# EAGLE design polar_lcd (EAGLE 9.3.0)
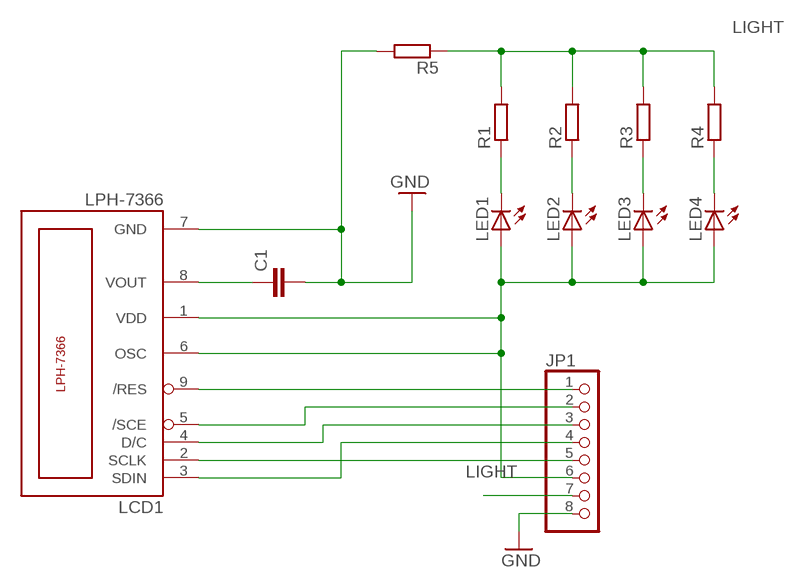
[diagram p0: schematic, sheet 1]

## Parts
C1  C-EUC0805  [C0805]
JP1  PINHD-1X8  [1X08]
LCD1  LPH-7366  [LPH-7366]
LED1  LEDSMT1206  [1206]
LED2  LEDSMT1206  [1206]
LED3  LEDSMT1206  [1206]
LED4  LEDSMT1206  [1206]
R1  R-EU_R0805  [R0805]
R2  R-EU_R0805  [R0805]
R3  R-EU_R0805  [R0805]
R4  R-EU_R0805  [R0805]
R5  R-EU_R0805  [R0805]

## Nets
GND: C1.2 JP1.8 LCD1.7(GND) R5.2
LIGHT: JP1.7 R1.2 R2.2 R3.2 R4.2 R5.1
N$1: JP1.1 LCD1.9(/RES)
N$2: C1.1 LCD1.8(VOUT)
N$3: JP1.6 LCD1.1(VDD) LCD1.6(OSC) LED1.A LED2.A LED3.A LED4.A
N$4: LED1.C R1.1
N$5: LED2.C R2.1
N$6: LED3.C R3.1
N$7: LED4.C R4.1
N$8: JP1.5 LCD1.2(SCLK)
N$9: JP1.4 LCD1.3(SDIN)
N$10: JP1.3 LCD1.4(D/C)
N$11: JP1.2 LCD1.5(/SCE)

## Library data of the parts
C1 = rcl:C-EU: CAPACITOR, European symbol; SPICEPREFIX: C
JP1 = pinhead:PINHD-1X8: PIN HEADER
LCD1 = lph-7366 (1):LPH-7366
LED1-LED4 = RepRapjr (1):LED: LED OSRAM: - CHIPLED LG R971, LG N971, LY N971, LG Q971, LY Q971, LO R971, LY R971 LH N974, LH R974 LS Q976, LO Q976, LY Q976 LO Q996 - Hyper CHIPLED LW Q18S LB Q993, LB Q99A, LB R99A - SideLED LS A670, LO A670, LY A670, LG A670, LP A670 LB A673, LV A673, LT A673, LW A673 LH A674 LY A675 LS A676, LA A676, LO A676, LY A676, LW A676 LS A679, LY A679, LG A679 - Hyper Micro SIDELED® LS Y876, LA Y876, LO Y876, LY Y876 LT Y87S - SmartLED LW L88C, LW L88S LB L89C, LB L89S, LG L890 LS L89K, LO L89K, LY L89K LS L896, LA L896, LO L896, LY L896 - TOPLED LS T670, LO T670, LY T670, LG T670, LP T670 LSG T670, LSP T670, LSY T670, LOP T670, LYG T670 LG T671, LOG T671, LSG T671 LB T673, LV T673, LT T673, LW T673 LH T674 LS T676, LA T676, LO T676, LY T676, LB T676, LH T676, LSB T676, LW T676 LB T67C, LV T67C, LT T67C, LS T67K, LO T67K, LY T67K, LW E67C LS E67B, LA E67B, LO E67B, LY E67B, LB E67C, LV E67C, LT E67C LW T67C LS T679, LY T679, LG T679 LS T770, LO T770, LY T770, LG T770, LP T770 LB T773, LV T773, LT T773, LW T773 LH T774 LS E675, LA E675, LY E675, LS T675 LS T776, LA T776, LO T776, LY T776, LB T776 LHGB T686 LT T68C, LB T68C - Hyper Mini TOPLED® LB M676 - Mini TOPLED Santana® LG M470 LS M47K, LO M47K, LY M47K Source: http://www.osram.convergy.de LUXEON: - LUMILED® LXK2-PW12-R00, LXK2-PW12-S00, LXK2-PW14-U00, LXK2-PW14-V00 LXK2-PM12-R00, LXK2-PM12-S00, LXK2-PM14-U00 LXK2-PE12-Q00, LXK2-PE12-R00, LXK2-PE12-S00, LXK2-PE14-T00, LXK2-PE14-U00 LXK2-PB12-K00, LXK2-PB12-L00, LXK2-PB12-M00, LXK2-PB14-N00, LXK2-PB14-P00, LXK2-PB14-Q00 LXK2-PR12-L00, LXK2-PR12-M00, LXK2-PR14-Q00, LXK2-PR14-R00 LXK2-PD12-Q00, LXK2-PD12-R00, LXK2-PD12-S00 LXK2-PH12-R00, LXK2-PH12-S00 LXK2-PL12-P00, LXK2-PL12-Q00, LXK2-PL12-R00 Source: www.luxeon.com KINGBRIGHT: KA-3528ASYC Source: www.kingbright.com
R1-R5 = rcl:R-EU_: RESISTOR, European symbol; SPICEPREFIX: R

## Board
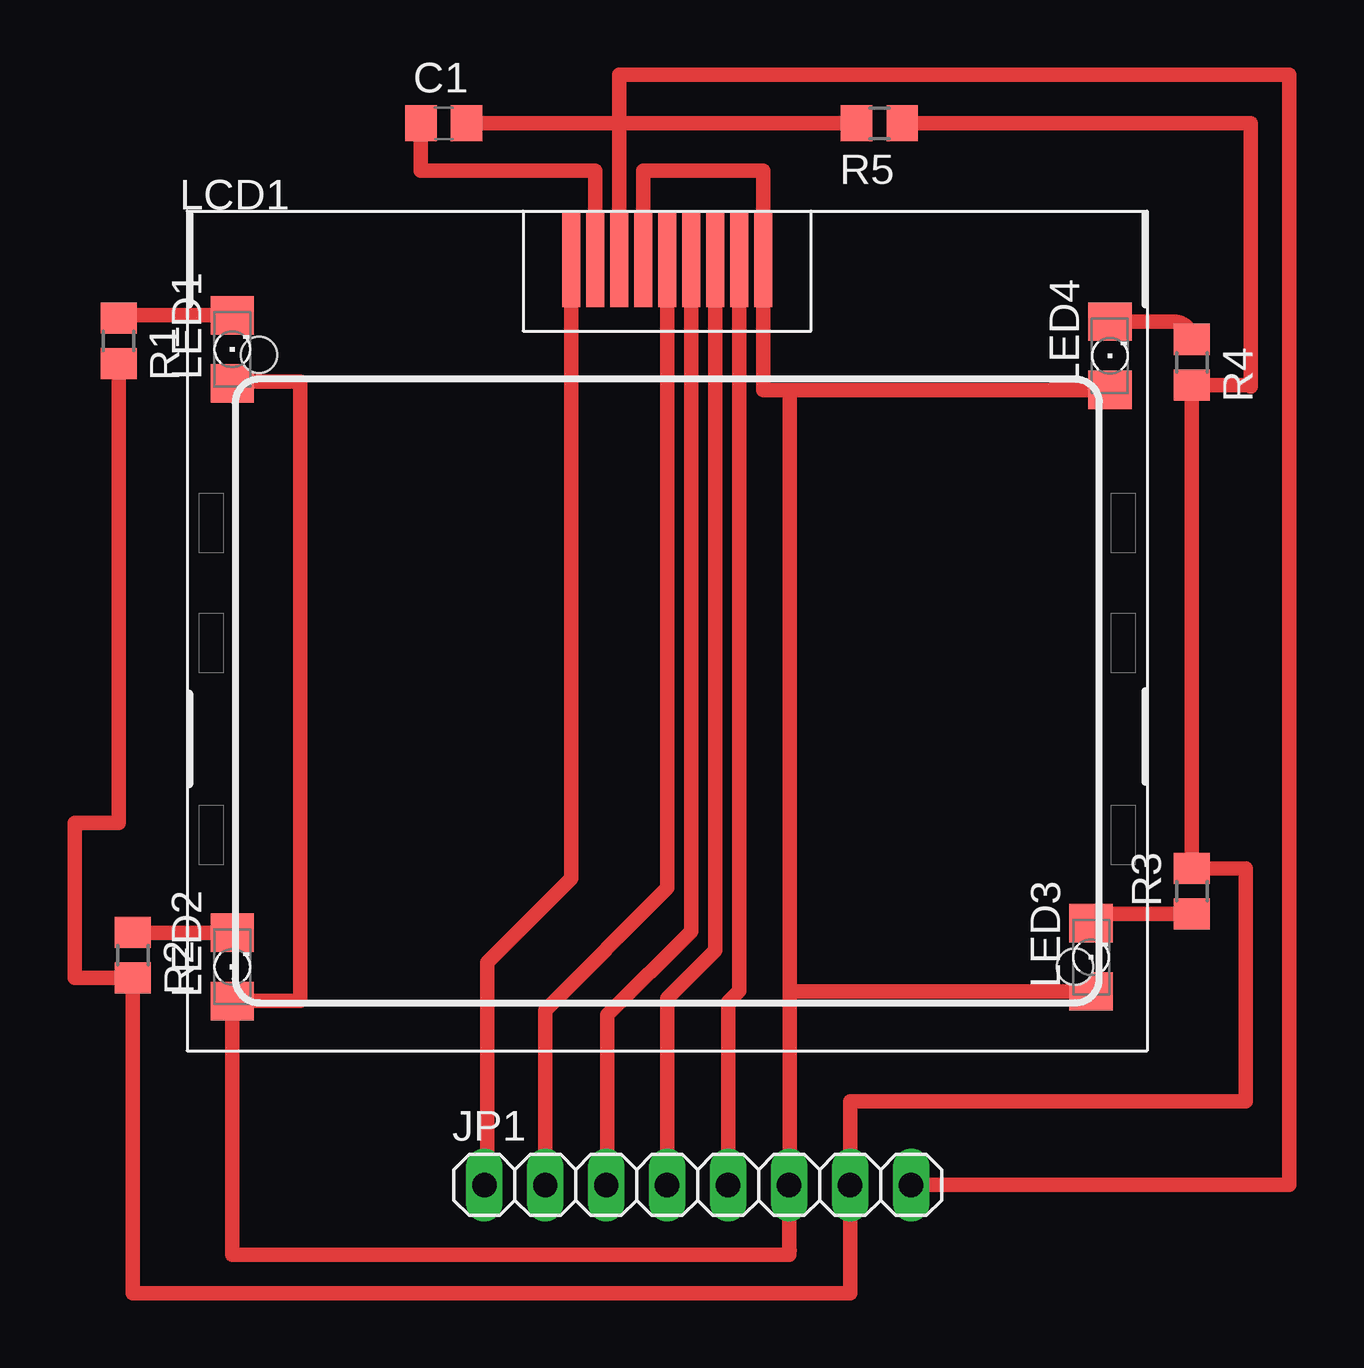
[diagram p1: board, top side]

No outline drawn. Coordinates in mm, seen from the top.
Copper layers (1*16): Top 0.035mm / dielectric 1.5mm / Bottom 0.035mm
Design rules "default": minimum track width 6mil, minimum drill 0.35mm, track to track 6mil, track to pad 6mil, pad to pad 6mil, via to via 6mil, smd to smd 6mil, copper to edge 40mil, drill to drill 6mil, minimum pad ring 10mil, minimum via ring 8mil, stop-mask expansion 4mil, vias tented up to drill 0mil, thermal gap 10mil

### Footprints (pad centres in the part's own frame; a part is rotated, then mirrored left to right if it is on the bottom)
C0805 = smd 1.3 x 1.5: 1 -0.95,0; 2 0.95,0
1X08 = drill 1.016 long: 1 -8.89,0; 2 -6.35,0; 3 -3.81,0; 4 -1.27,0; 5 1.27,0; 6 3.81,0; 7 6.35,0; 8 8.89,0
LPH-7366 = smd 0.75 x 4: 1 4,17; 2 3,17; 3 2,17; 4 1,17; 5 0,17; 6 -1,17; 7 -2,17; 8 -3,17; 9 -4,17 | hole 1.5: -17,13; 17,-12.5
1206 = smd 1.6 x 1.803: A -1.422,0; C 1.422,0
R0805 = smd 1.3 x 1.5: 1 -0.95,0; 2 0.95,0

### Placement (x,y rotation side)
C1  -0.42,-11.63 0 top
JP1  10.16,-55.88 0 top
LCD1  8.89,-34.29 0 top
LED1  -9.23,-21.05 90 top
LED2  -9.23,-46.79 90 top
LED3  26.55,-46.39 90 top
LED4  27.34,-21.32 90 top
R1  -13.97,-20.7 270 top
R2  -13.37,-46.3 270 top
R3  30.75,-43.64 90 top
R4  30.75,-21.59 270 top
R5  17.73,-11.63 180 top

### Tracks (layer width: path | path; a pad name or v marks a point on that pad's centre or on a via)
GND
  Top 0.61: C1.2 6.89,-11.63 | 6.89,-11.63 LCD1.7 | R5.2 6.89,-11.63 | JP1.8 34.8,-55.88 34.8,-9.6 6.89,-9.6 6.89,-11.63
LIGHT
  Top 0.61: R1.2 -13.97,-40.8 -15.8,-40.8 -15.8,-47.25 R2.2 -13.37,-60.4 16.51,-60.4 JP1.7 16.51,-52.4 33,-52.4 33,-42.69 R3.2 R4.2 33.2,-22.54 | R5.1 33.2,-11.63 33.2,-22.54 | 33.2,-22.6 33.2,-22.54
N$1
  Top 0.61: LCD1.9 4.89,-43.11 1.4,-46.6 1.4,-55.75 JP1.1
N$2
  Top 0.61: C1.1 -1.37,-13.6 5.89,-13.6 LCD1.8
N$3
  Top 0.61: LCD1.6 7.89,-13.6 12.89,-13.6 LCD1.1 12.89,-22.74 LED4.A 14,-22.74 14,-47.8 | 14,-58.6 13.97,-58.6 | 13.97,-58.6 13.97,-58.8 -9.23,-58.8 LED2.A -6.4,-48.21 -6.4,-22.4 -9.16,-22.4 LED1.A | 13.97,-58.6 JP1.6 14,-55.88 14,-47.8 | 14,-47.8 arc90 14.01,-47.81 LED3.A
N$4
  Top 0.61: LED1.C -13.97,-19.63 R1.1
N$5
  Top 0.61: R2.1 -13.37,-45.37 LED2.C
N$6
  Top 0.61: LED3.C arc-90 26.93,-44.59 R3.1
N$7
  Top 0.61: LED4.C 30.01,-19.9 arc-90 R4.1
N$8
  Top 0.61: LCD1.2 11.89,-47.8 11.43,-48.26 JP1.5
N$9
  Top 0.61: LCD1.3 10.89,-46.11 8.89,-48.11 JP1.4
N$10
  Top 0.61: LCD1.4 9.89,-45.31 6.4,-48.8 6.4,-55.83 JP1.3
N$11
  Top 0.61: LCD1.5 8.89,-43.51 3.8,-48.6 JP1.2